# EasyEDA Pro project sonos_knobs_v1.1.eprj, schematic Schematic1

## Sheets
1 P1: Board Name: Board1; Create Date: 2025-01-11; Page Name: P1; Project Name: sonos_knobs; Schematic Name: Schematic1; Update Date: 2025-01-27; Company: EasyEDA.com; Page Size: A4; Version: V1.0
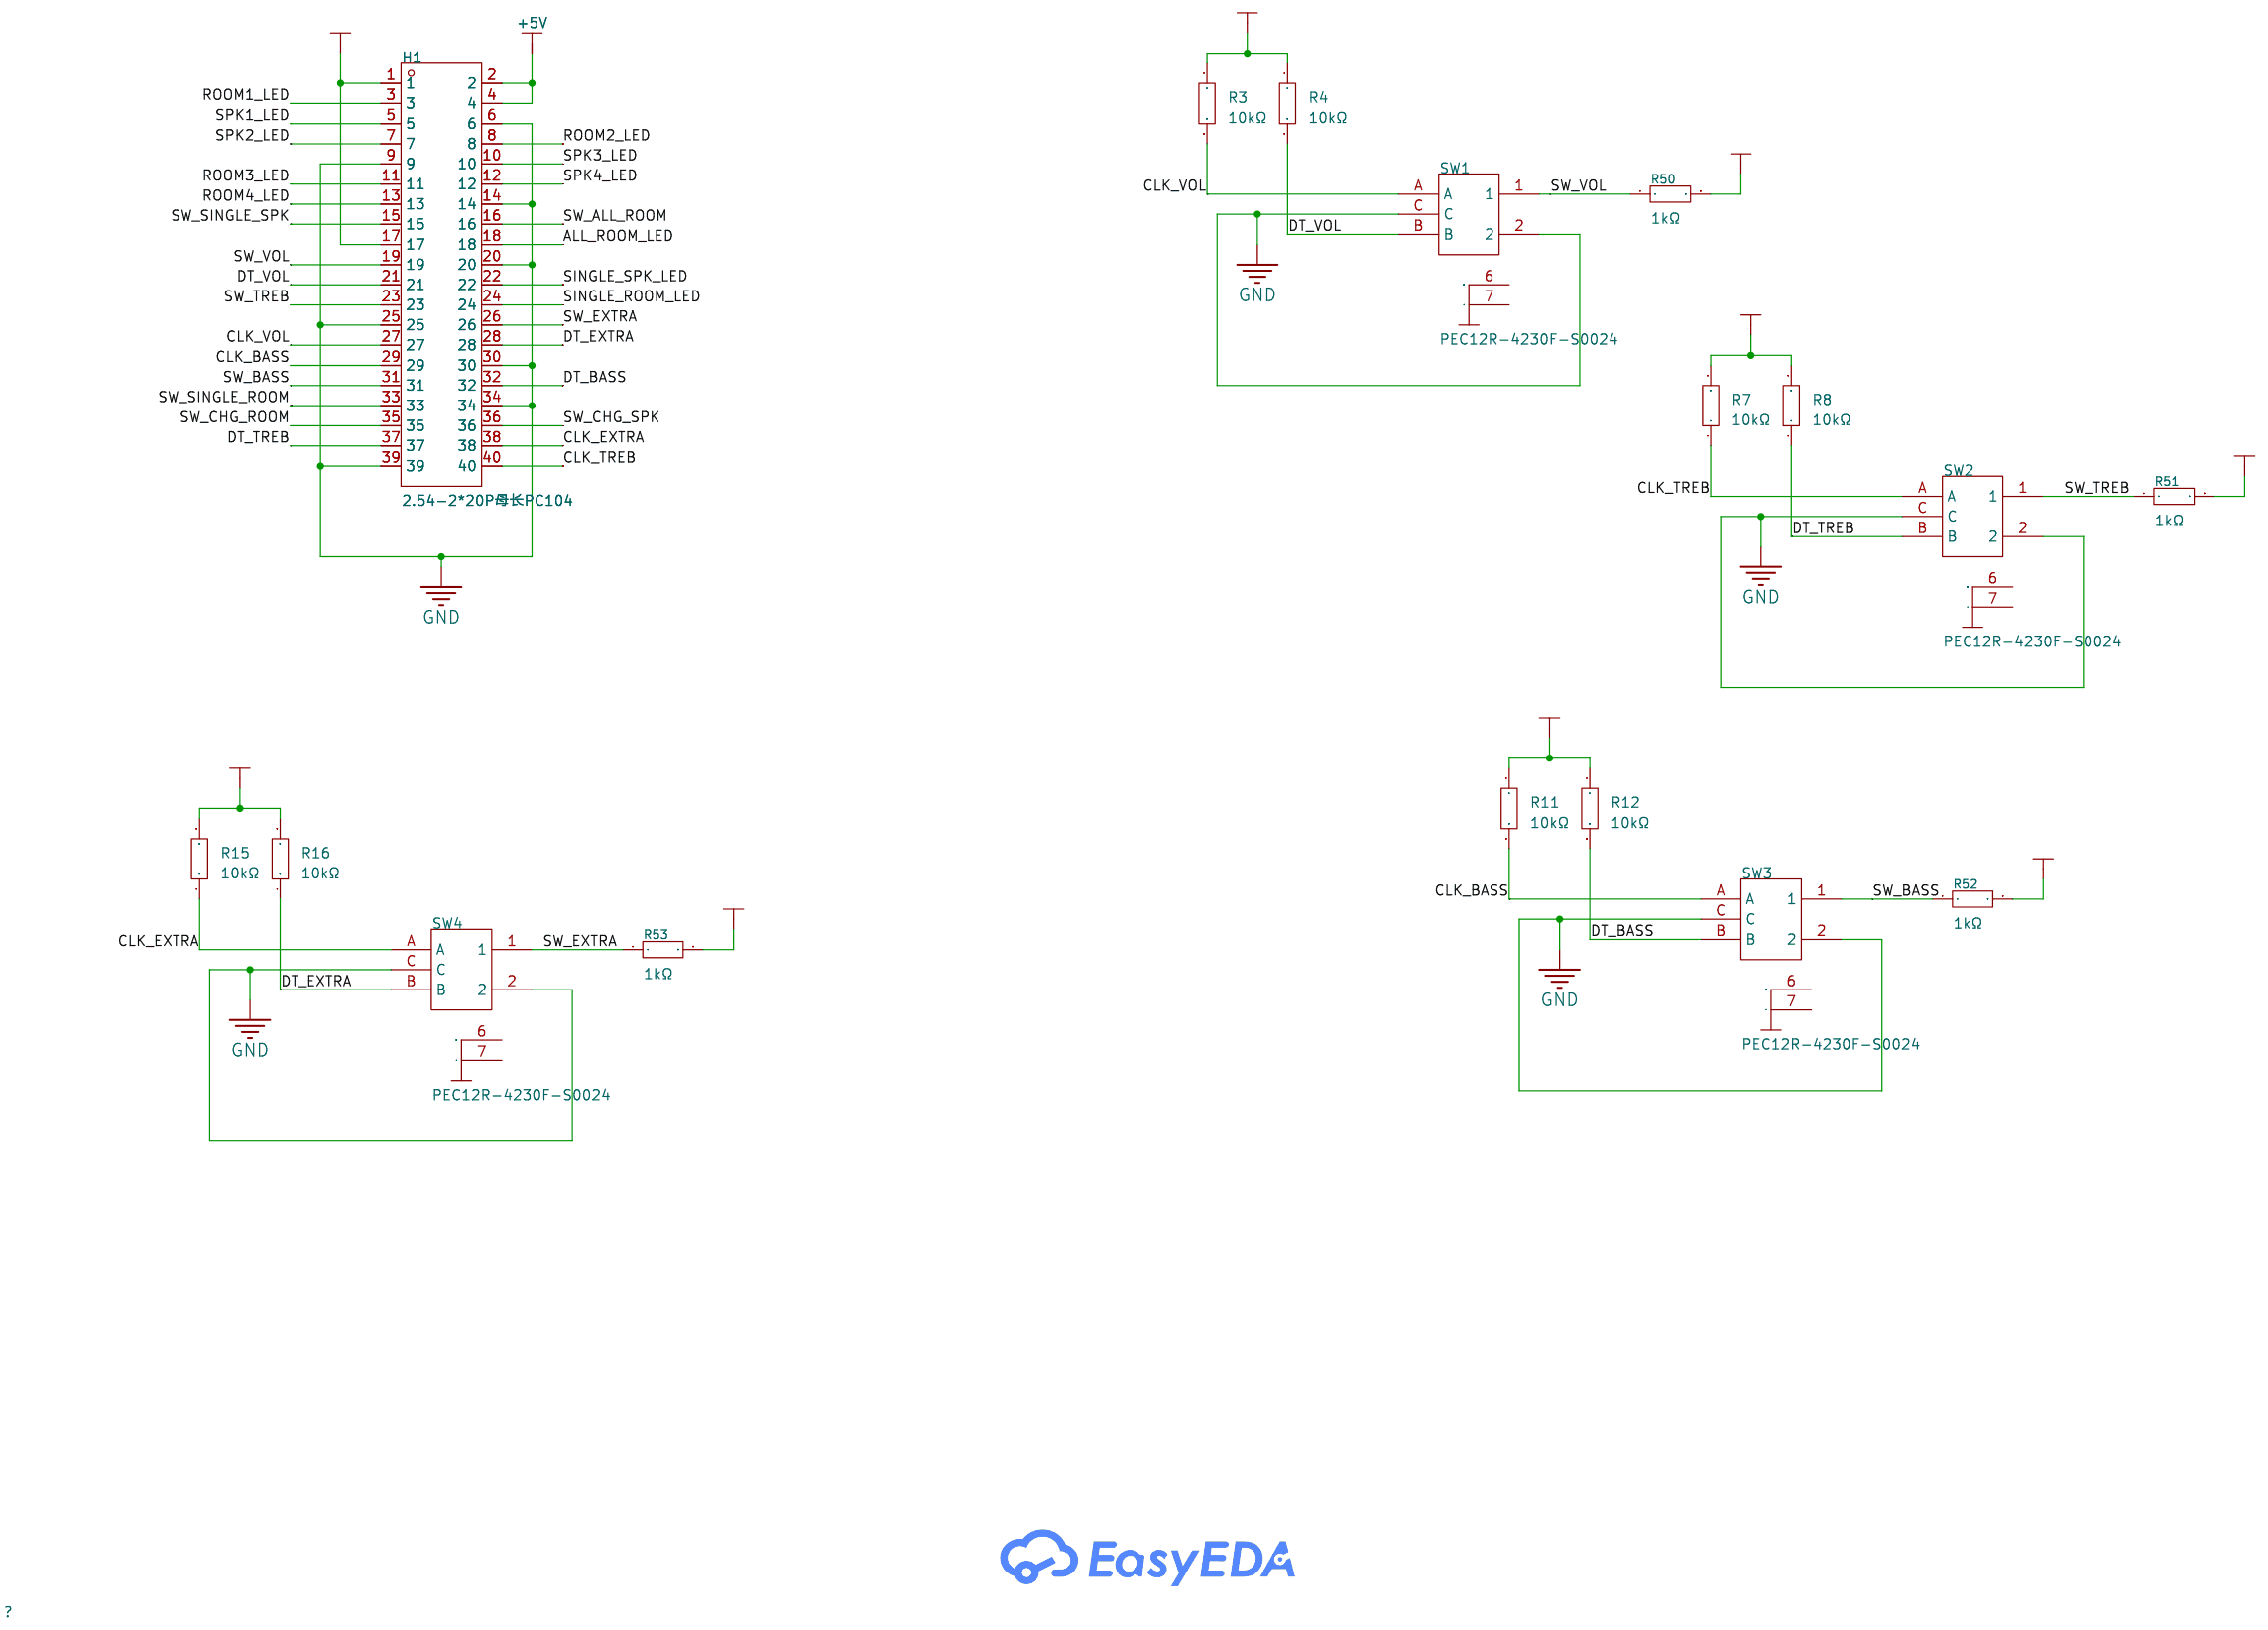
[diagram p0: P1]
2 P2: Create Date: 2025-01-12; Page Name: P2; Update Date: 2025-01-13
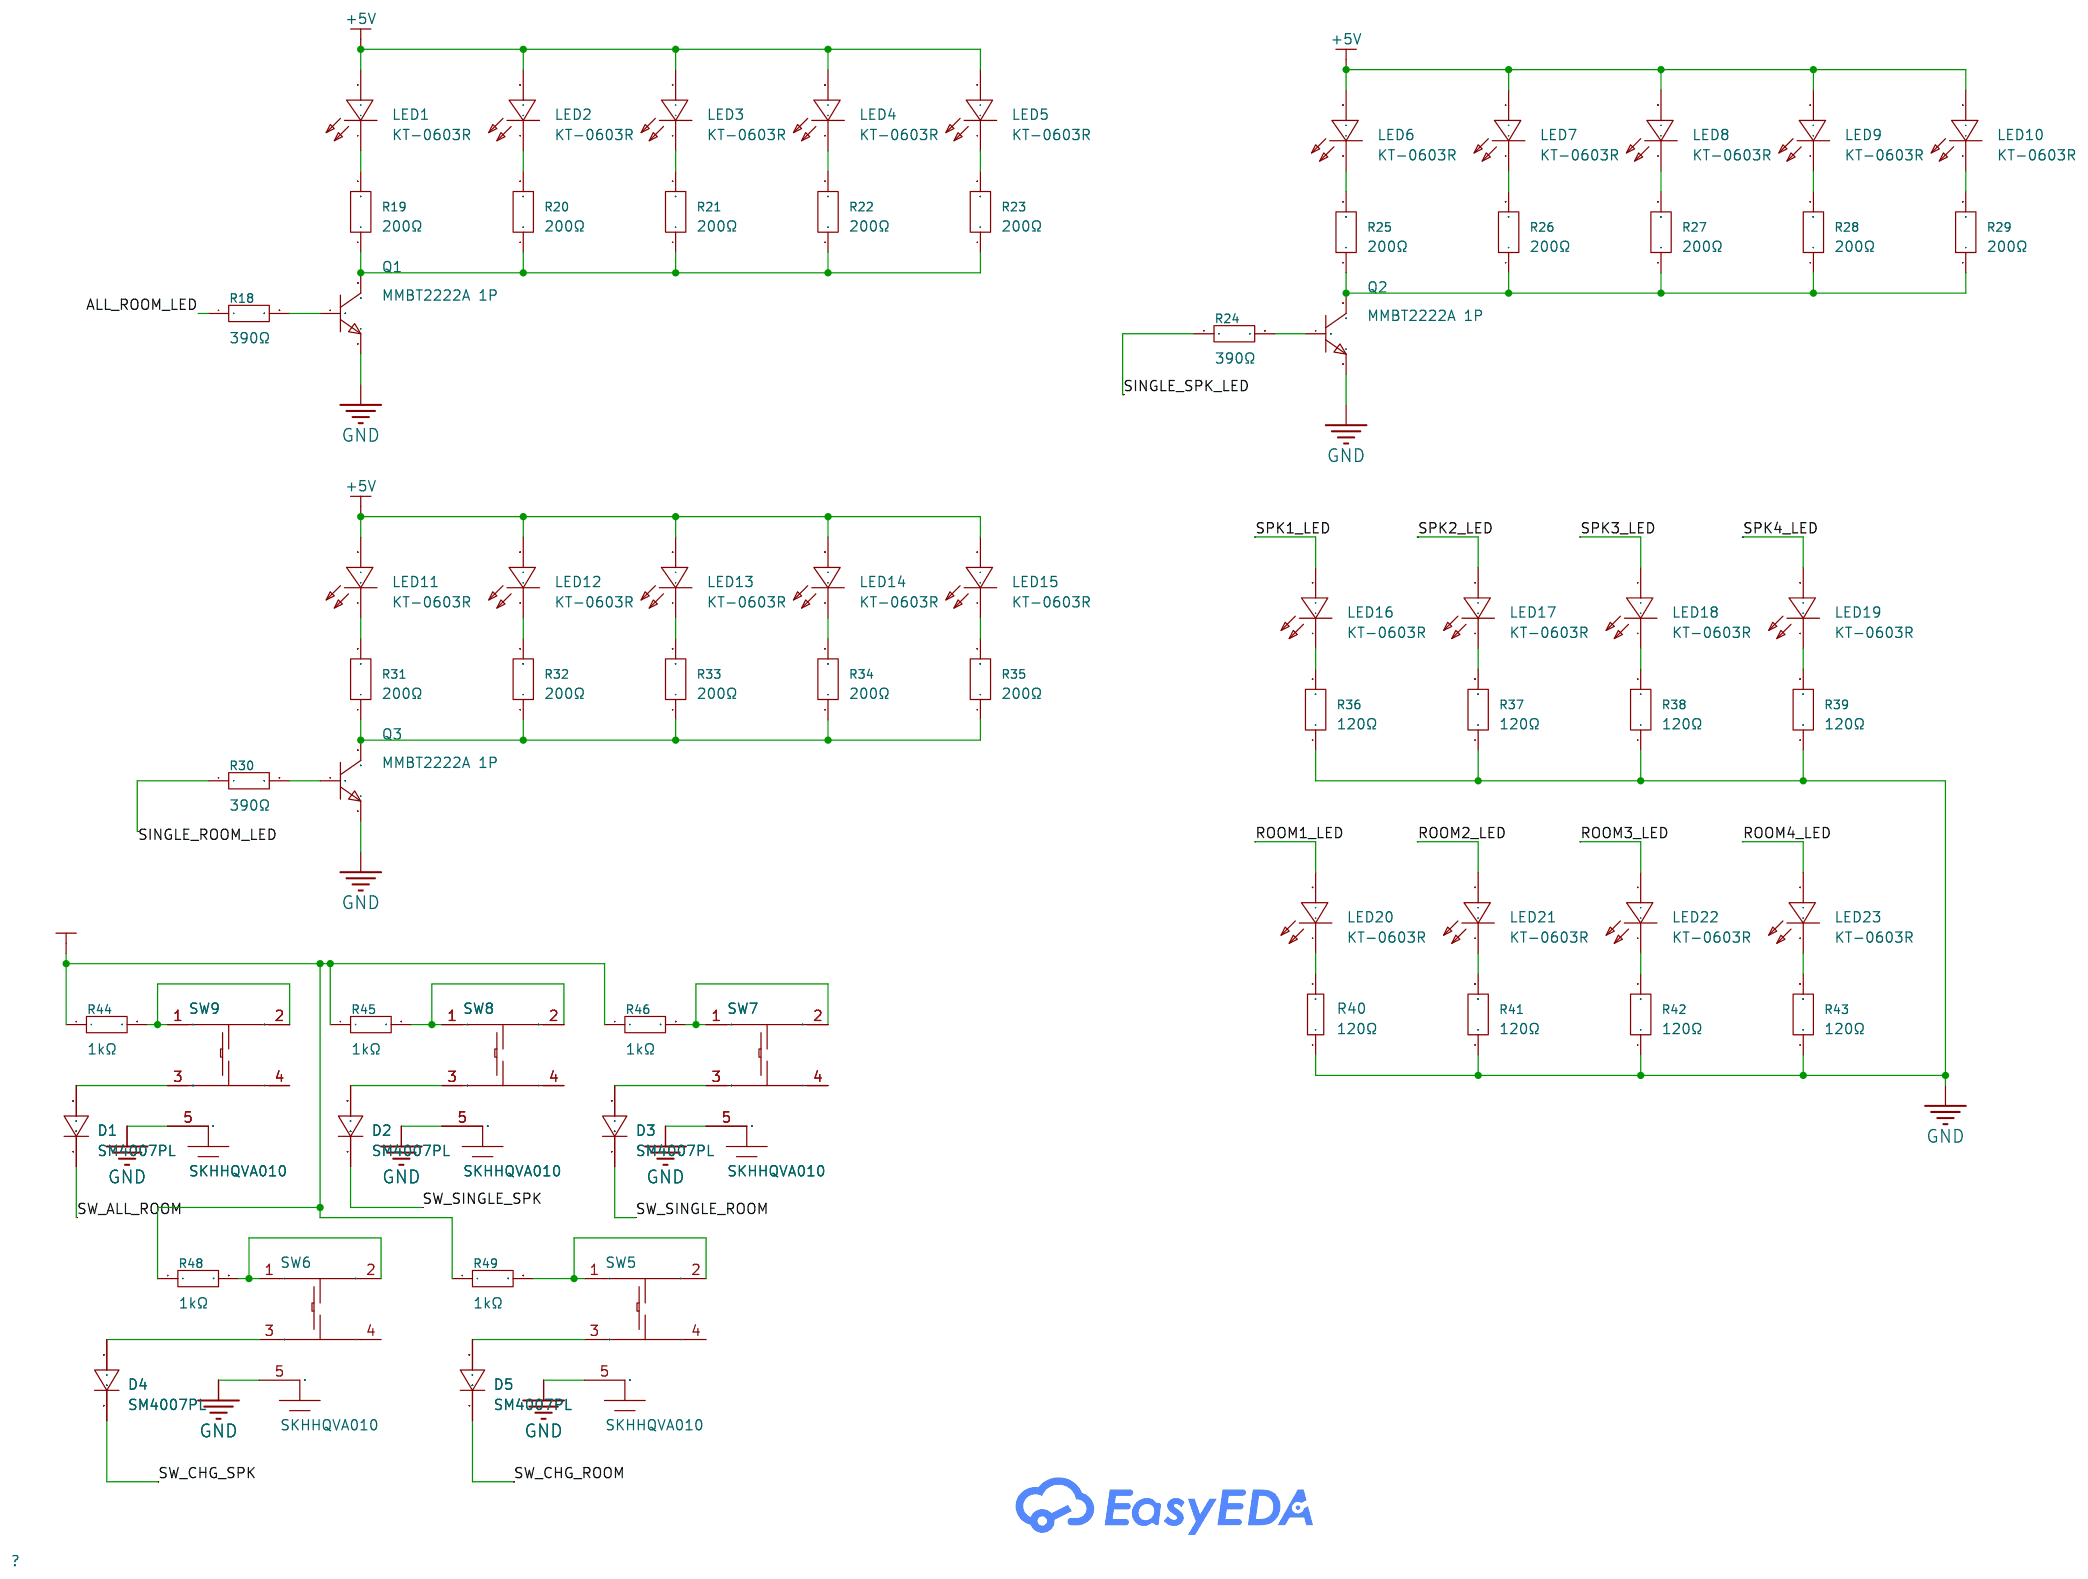
[diagram p1: P2]

## Parts
sheet P1
H1  2.54-2*20P母长PC104  [HDR-TH_40P-P2.54-V-F-R2-C20-S2.54-2]
R3  10kΩ  [C0402]
R4  10kΩ  [C0402]
R7  10kΩ  [C0402]
R8  10kΩ  [C0402]
R11  10kΩ  [C0402]
R12  10kΩ  [C0402]
R15  10kΩ  [C0402]
R16  10kΩ  [C0402]
R50  1kΩ  [C0402]
R51  1kΩ  [C0402]
R52  1kΩ  [C0402]
R53  1kΩ  [C0402]
SW1  PEC12R-4230F-S0024  [SW-TH_PEC12R-4230F-S0024]
SW2  PEC12R-4230F-S0024  [SW-TH_PEC12R-4230F-S0024]
SW3  PEC12R-4230F-S0024  [SW-TH_PEC12R-4230F-S0024]
SW4  PEC12R-4230F-S0024  [SW-TH_PEC12R-4230F-S0024]
sheet P2
D1  SM4007PL  [SOD-123F_L2.8-W1.8-LS3.7-RD]
D2  SM4007PL  [SOD-123F_L2.8-W1.8-LS3.7-RD]
D3  SM4007PL  [SOD-123F_L2.8-W1.8-LS3.7-RD]
D4  SM4007PL  [SOD-123F_L2.8-W1.8-LS3.7-RD]
D5  SM4007PL  [SOD-123F_L2.8-W1.8-LS3.7-RD]
LED1  KT-0603R  [LED0603-RD]
LED2  KT-0603R  [LED0603-RD]
LED3  KT-0603R  [LED0603-RD]
LED4  KT-0603R  [LED0603-RD]
LED5  KT-0603R  [LED0603-RD]
LED6  KT-0603R  [LED0603-RD]
LED7  KT-0603R  [LED0603-RD]
LED8  KT-0603R  [LED0603-RD]
LED9  KT-0603R  [LED0603-RD]
LED10  KT-0603R  [LED0603-RD]
LED11  KT-0603R  [LED0603-RD]
LED12  KT-0603R  [LED0603-RD]
LED13  KT-0603R  [LED0603-RD]
LED14  KT-0603R  [LED0603-RD]
LED15  KT-0603R  [LED0603-RD]
LED16  KT-0603R  [LED0603-RD]
LED17  KT-0603R  [LED0603-RD]
LED18  KT-0603R  [LED0603-RD]
LED19  KT-0603R  [LED0603-RD]
LED20  KT-0603R  [LED0603-RD]
LED21  KT-0603R  [LED0603-RD]
LED22  KT-0603R  [LED0603-RD]
LED23  KT-0603R  [LED0603-RD]
Q1  MMBT2222A 1P  [SOT-23-3_L2.9-W1.3-P1.90-LS2.4-BR]
Q2  MMBT2222A 1P  [SOT-23-3_L2.9-W1.3-P1.90-LS2.4-BR]
Q3  MMBT2222A 1P  [SOT-23-3_L2.9-W1.3-P1.90-LS2.4-BR]
R18  390Ω  [C0402]
R19  200Ω  [C0402]
R20  200Ω  [C0402]
R21  200Ω  [C0402]
R22  200Ω  [C0402]
R23  200Ω  [C0402]
R24  390Ω  [C0402]
R25  200Ω  [C0402]
R26  200Ω  [C0402]
R27  200Ω  [C0402]
R28  200Ω  [C0402]
R29  200Ω  [C0402]
R30  390Ω  [C0402]
R31  200Ω  [C0402]
R32  200Ω  [C0402]
R33  200Ω  [C0402]
R34  200Ω  [C0402]
R35  200Ω  [C0402]
R36  120Ω  [C0402]
R37  120Ω  [C0402]
R38  120Ω  [C0402]
R39  120Ω  [C0402]
R40  120Ω  [C0402]
R41  120Ω  [C0402]
R42  120Ω  [C0402]
R43  120Ω  [C0402]
R44  1kΩ  [C0402]
R45  1kΩ  [C0402]
R46  1kΩ  [C0402]
R48  1kΩ  [C0402]
R49  1kΩ  [C0402]
SW5  SKHHQVA010  [SW-TH_5P-L6.0-W6.0-P4.50-LS6.5]
SW6  SKHHQVA010  [SW-TH_5P-L6.0-W6.0-P4.50-LS6.5]
SW7  SKHHQVA010  [SW-TH_5P-L6.0-W6.0-P4.50-LS6.5]
SW8  SKHHQVA010  [SW-TH_5P-L6.0-W6.0-P4.50-LS6.5]
SW9  SKHHQVA010  [SW-TH_5P-L6.0-W6.0-P4.50-LS6.5]

## Library data of the parts
H1 = 2.54-2*20P母长PC104: Holes Structure:2x20P Pitch:2.54mm Row Spacing:2.54mm Mounting Type:Straight Number of Rows:双排 Number of Holes:40P Insulation Height:- Contact Material:Brass Contact Plating:-; LCSC Part Name: 间距:2.54mm 2x20P 直插; Supplier Part: C35165; Manufacturer: BOOMELE(博穆精密); Supplier Footprint: 插件,P=2.54mm; JLCPCB Part Class: Extended Part; Datasheet: https://atta.szlcsc.com/upload/public/pdf/source/20151109/1457707557259.pdf; Supplier: LCSC; Holes Structure: 2x20P; Pitch: 2.54mm; Row Spacing: 2.54mm; Mounting Type: Straight; Number of Rows: 双排; Number of Holes: 40P; Contact Material: Brass
R3 R4 R7 R8 R11 R12 R15 R16 = 0402WGF1002TCE: Type:Thick Film Resistors Resistance:10kΩ Tolerance:±1% Tolerance:±1% Power(Watts): Overload Voltage (Max): Temperature Coefficient:±100ppm/℃ Temperature Coefficient:±100ppm/℃ Operating Temperature Range:-55℃~+155℃ Operating Temperature Range:-55℃~+155℃; LCSC Part Name: 10kΩ ±1% 62.5mW 厚膜电阻; Supplier Part: C25744; Manufacturer: UNI-ROYAL(厚声); Supplier Footprint: 0402; JLCPCB Part Class: Basic Part; Datasheet: https://atta.szlcsc.com/upload/public/pdf/source/20200306/C422600_1E6D84923E4A46A82E41ADD87F860B5C.pdf; Supplier: LCSC; Type: Thick Film Resistors; Tolerance: ±1%; Temperature Coefficient: ±100ppm/℃; Operating Temperature Range: -55℃~+155℃
R44-R46 R48-R53 = 0402WGF1001TCE: Type:Thick Film Resistors Resistance:1kΩ Tolerance:±1% Tolerance:±1% Power(Watts): Overload Voltage (Max): Temperature Coefficient:±100ppm/℃ Temperature Coefficient:±100ppm/℃ Operating Temperature Range:-55℃~+155℃ Operating Temperature Range:-55℃~+155℃; LCSC Part Name: 1kΩ ±1% 62.5mW 厚膜电阻; Supplier Part: C11702; Manufacturer: UNI-ROYAL(厚声); Supplier Footprint: 0402; JLCPCB Part Class: Basic Part; Datasheet: https://atta.szlcsc.com/upload/public/pdf/source/20200306/C422600_1E6D84923E4A46A82E41ADD87F860B5C.pdf; Supplier: LCSC; Type: Thick Film Resistors; Tolerance: ±1%; Temperature Coefficient: ±100ppm/℃; Operating Temperature Range: -55℃~+155℃
SW1-SW4 = PEC12R-4230F-S0024: Supplier Part: C143818; Manufacturer: BOURNS; Supplier Footprint: 插件; JLCPCB Part Class: Extended Part; Datasheet: https://atta.szlcsc.com/upload/public/pdf/source/20171128/C143818_15118626940771147316.pdf; Supplier: LCSC
D1-D5 = SM4007PL_C64898: Diode Configuration: Forward Voltage (Vf@If):1.1V@1A Reverse Voltage (Vr): Rectified Current: Reverse Leakage Current:10uA@1kV; LCSC Part Name: 电压:1kV 电流:1A; Supplier Part: C64898; Manufacturer: MDD(辰达半导体); Supplier Footprint: SOD-123FL; JLCPCB Part Class: Basic Part; Datasheet: https://atta.szlcsc.com/upload/public/pdf/source/20230823/16A8FDE162764C9B685A3717F2DA3690.pdf; Supplier: LCSC; Forward Voltage (Vf@If): 1.1V@1A; Reverse Leakage Current: 10uA@1kV
LED1-LED23 = KT-0603R: Emitted Color:Red Power Dissipation:- Forward Current:- Dominant Wavelength:- Dominant Wavelength:- Peak Wavelength:- Diode Configuration:- Lens Color:- Color Temperature:- Color Temperature:- Viewing Angle:- Mounting Sytle:- Operating Temperature:-40℃~+8; LCSC Part Name: 0603 红灯 高亮; Supplier Part: C2286; Manufacturer: KENTO; Supplier Footprint: 0603; JLCPCB Part Class: Basic Part; Datasheet: https://atta.szlcsc.com/upload/public/pdf/source/20160616/1466072038404.pdf; Supplier: LCSC; Emitted Color: Red; Operating Temperature: -40℃~+85℃
Q1-Q3 = MMBT2222A 1P: Transistor type: Collector Current (Ic): Collector-Emitter Breakdown Voltage (Vceo): Power Dissipation (Pd): DC Current Gain (hFE@Ic,Vce):100@150mA,10V DC Current Gain (hFE@Ic,Vce):100@150mA,10V Transition Frequency (fT):300MHz Collector Cut-Off Current (; LCSC Part Name: 丝印1P; Supplier Part: C8512; Manufacturer: CJ(江苏长电/长晶); Supplier Footprint: SOT-23; JLCPCB Part Class: Basic Part; Datasheet: https://atta.szlcsc.com/upload/public/pdf/source/20140815/1457707223705.pdf; Supplier: LCSC; DC Current Gain (hFE@Ic,Vce): 100@150mA,10V; Transition Frequency (fT): 300MHz; Collector Cut-Off Current (Icbo): 10nA; Collector-Emitter Saturation Voltage (VCE(sat)@Ic,Ib): 1V@500mA,50mA; Operating Temperature: -55℃~+150℃
R18 R24 R30 = ERJ2RKF3900X: Type:Thick Film Resistors Resistance: Tolerance:±1% Tolerance:±1% Power(Watts): Overload Voltage (Max):- Temperature Coefficient:±100ppm/℃ Temperature Coefficient:±100ppm/℃ Operating Temperature Range:-55℃~+155℃ Operating Temperature Range:-55℃~+155℃; LCSC Part Name: 390Ω ±1% 100mW 厚膜电阻; Supplier Part: C413074; Manufacturer: PANASONIC(松下); Supplier Footprint: 0402; JLCPCB Part Class: Extended Part; Datasheet: https://atta.szlcsc.com/upload/public/pdf/source/20190820/C413074_2E7F65CF489534BE24B62AC3F5A5C193.pdf; Supplier: LCSC; Type: Thick Film Resistors; Tolerance: ±1%; Temperature Coefficient: ±100ppm/℃; Operating Temperature Range: -55℃~+155℃
R19-R23 R25-R29 R31-R35 = CRCW0402200RFKEDHP: Type:Thick Film Resistors Resistance: Tolerance:±1% Tolerance:±1% Power(Watts): Overload Voltage (Max):- Temperature Coefficient:±100ppm/℃ Temperature Coefficient:±100ppm/℃ Operating Temperature Range:-55℃~+155℃ Operating Temperature Range:-55℃~+155℃; LCSC Part Name: 厚膜电阻 200Ω ±1% 200mW; Supplier Part: C313368; Manufacturer: VISHAY(威世); Supplier Footprint: 0402; JLCPCB Part Class: Extended Part; Datasheet: https://atta.szlcsc.com/upload/public/pdf/source/20210604/C313331_E473B8439F7FFAF3542CD19A2CACB439.pdf; Supplier: LCSC; Type: Thick Film Resistors; Tolerance: ±1%; Temperature Coefficient: ±100ppm/℃; Operating Temperature Range: -55℃~+155℃
R36-R43 = 0402WGF1200TCE: Type:Thick Film Resistors Resistance: Tolerance:±1% Tolerance:±1% Power(Watts): Overload Voltage (Max): Temperature Coefficient:±100ppm/℃ Temperature Coefficient:±100ppm/℃ Operating Temperature Range:-55℃~+155℃ Operating Temperature Range:-55℃~+155℃; LCSC Part Name: 120Ω ±1% 62.5mW 厚膜电阻; Supplier Part: C25079; Manufacturer: UNI-ROYAL(厚声); Supplier Footprint: 0402; JLCPCB Part Class: Basic Part; Datasheet: https://atta.szlcsc.com/upload/public/pdf/source/20200306/C422600_1E6D84923E4A46A82E41ADD87F860B5C.pdf; Supplier: LCSC; Type: Thick Film Resistors; Tolerance: ±1%; Temperature Coefficient: ±100ppm/℃; Operating Temperature Range: -55℃~+155℃
SW5-SW9 = SKHHQVA010: Circuit:SPST Self Lock / No Lock:- Actuator Style:Round Button IP Rating:- Mounting Style:Straight Contact Current:50mA Voltage Rating (AC):- Voltage Rating (DC):12V Insulation Resistance:100MΩ Actuator/Cap Color:Black With Lamp:- Pin Style:PCPin Operatin; Supplier Part: C470256; Manufacturer: ALPSALPINE(阿尔卑斯阿尔派); Supplier Footprint: 插件; JLCPCB Part Class: Extended Part; Datasheet: https://atta.szlcsc.com/upload/public/pdf/source/20191216/C470264_63428590B8293B8A230AD4C66BC7B9F6.pdf; Supplier: LCSC; Circuit: SPST; Actuator Style: Round Button; Mounting Style: Straight; Contact Current: 50mA; Voltage Rating (DC): 12V; Insulation Resistance: 100MΩ; Actuator/Cap Color: Black; Pin Style: PCPin; Operating Force: 0.98N; Operating Temperature: -40℃~+90℃; Mechanical Life: 100万次

## Nets
+3.3V: H1.1 H1.17 R3.1 R4.1 R7.2 R8.2 R11.1 R12.1 R15.2 R16.2 R44.1 R45.1 R46.1 R48.1 R49.1 R50.2 R51.2 R52.2 R53.2
+5V: H1.2 H1.4 LED1.2(A) LED2.2(A) LED3.2(A) LED4.2(A) LED5.2(A) LED6.2(A) LED7.2(A) LED8.2(A) LED9.2(A) LED10.2(A) LED11.2(A) LED12.2(A) LED13.2(A) LED14.2(A) LED15.2(A)
GND: H1.6 H1.9 H1.14 H1.20 H1.25 H1.30 H1.34 H1.39 Q1.2(E) Q2.2(E) Q3.2(E) R36.1 R37.1 R38.1 R39.1 R40.1 R41.1 R42.1 R43.1 SW1.2 SW1.C SW2.2 SW2.C SW3.2 SW3.C SW4.2 SW4.C SW5.5 SW6.5 SW7.5 SW8.5 SW9.5
ALL_ROOM_LED: H1.18 R18.1
CLK_BASS: H1.29 R11.2 SW3.A
CLK_EXTRA: H1.38 R15.1 SW4.A
CLK_TREB: H1.40 R7.1 SW2.A
CLK_VOL: H1.27 R3.2 SW1.A
DT_BASS: H1.32 R12.2 SW3.B
DT_EXTRA: H1.28 R16.1 SW4.B
DT_TREB: H1.37 R8.1 SW2.B
DT_VOL: H1.21 R4.2 SW1.B
ROOM1_LED: H1.3 LED20.2(A)
ROOM2_LED: H1.8 LED21.2(A)
ROOM3_LED: H1.11 LED22.2(A)
ROOM4_LED: H1.13 LED23.2(A)
SINGLE_ROOM_LED: H1.24 R30.1
SINGLE_SPK_LED: H1.22 R24.1
SPK1_LED: H1.5 LED16.2(A)
SPK2_LED: H1.7 LED17.2(A)
SPK3_LED: H1.10 LED18.2(A)
SPK4_LED: H1.12 LED19.2(A)
SW_ALL_ROOM: D1.1(C) H1.16
SW_BASS: H1.31 R52.1 SW3.1
SW_CHG_ROOM: D5.1(C) H1.35
SW_CHG_SPK: D4.1(C) H1.36
SW_EXTRA: H1.26 R53.1 SW4.1
SW_SINGLE_ROOM: D3.1(C) H1.33
SW_SINGLE_SPK: D2.1(C) H1.15
SW_TREB: H1.23 R51.1 SW2.1
SW_VOL: H1.19 R50.1 SW1.1
$2N553: Q1.1(B) R18.2
$2N557: Q1.3(C) R19.1 R20.1 R21.1 R22.1 R23.1
$2N567: LED1.1(K) R19.2
$2N579: LED2.1(K) R20.2
$2N581: LED3.1(K) R21.2
$2N583: LED4.1(K) R22.2
$2N585: LED5.1(K) R23.2
$2N1083: Q2.1(B) R24.2
$2N1087: Q2.3(C) R25.1 R26.1 R27.1 R28.1 R29.1
$2N1097: LED6.1(K) R25.2
$2N1109: LED7.1(K) R26.2
$2N1111: LED8.1(K) R27.2
$2N1113: LED9.1(K) R28.2
$2N1115: LED10.1(K) R29.2
$2N1613: Q3.1(B) R30.2
$2N1617: Q3.3(C) R31.1 R32.1 R33.1 R34.1 R35.1
$2N1627: LED11.1(K) R31.2
$2N1639: LED12.1(K) R32.2
$2N1641: LED13.1(K) R33.2
$2N1643: LED14.1(K) R34.2
$2N1645: LED15.1(K) R35.2
$2N2275: LED16.1(K) R36.2
$2N2279: LED17.1(K) R37.2
$2N2284: LED18.1(K) R38.2
$2N2289: LED19.1(K) R39.2
$2N2294: LED20.1(K) R40.2
$2N2299: LED21.1(K) R41.2
$2N2307: LED22.1(K) R42.2
$2N2312: LED23.1(K) R43.2
$2N6344: R44.2 SW9.1 SW9.2
$2N6348: R45.2 SW8.1 SW8.2
$2N6353: R46.2 SW7.1 SW7.2
$2N6358: R49.2 SW5.1 SW5.2
$2N6363: R48.2 SW6.1 SW6.2
$2N6573: D1.2(A) SW9.3
$2N6576: D2.2(A) SW8.3
$2N6578: D3.2(A) SW7.3
$2N6580: D5.2(A) SW5.3
$2N6582: D4.2(A) SW6.3

Not connected (* = marked no-connect by the designer): SW1 6 7; SW2 6 7; SW3 6 7; SW4 6 7; SW5 4; SW6 4; SW7 4; SW8 4; SW9 4
